# Altium schematic sheet 3V3_BUCK_0603.SchDoc
size A
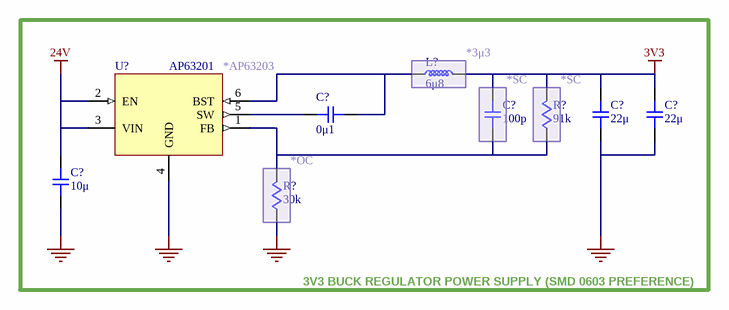
[diagram p0: 3V3_BUCK_0603.SchDoc]

## Parts
(Parts that share a designator on the sheet are numbered #1, #2 ... from top to bottom, then left to right.)
C?#1  0μ1  [MJB_CAP_0603]
C?#2  100p  [MJB_CAP_0603]
C?#3  22μ  [MJB_CAP_0805]
C?#4  22μ  [MJB_CAP_0805]
C?#5  10μ  [MJB_CAP_0805]
L?  6μ8  [MJB_IND_ASPI]
R?#1  91k  [MJB_RES_0603]
R?#2  30k  [MJB_RES_0603]
U?  AP63201  [mjb_AP6320X]

## Nets
3V3: C?#2.2 C?#3.2 C?#4.2 L?.2 R?#1.2
24V: C?#5.2 U?.2(EN) U?.3(VIN)
GND: C?#3.1 C?#4.1 C?#5.1 R?#2.1 U?.4(GND)
NetC?#1_1: C?#1.1 U?.5(SW)
NetC?#1_2: C?#1.2 L?.1 U?.6(BST)
NetC?#2_1: C?#2.1 R?#1.1 R?#2.2 U?.1(FB)

## Notes on the sheet
- (near U?) *AP63203
- (near L?) *3μ3
- *SC
- (near R?#2) *OC
- 3V3 BUCK REGULATOR POWER SUPPLY (SMD 0603 PREFERENCE)

## Library data of the parts
C?#1 C?#2 = CAP_0603: Capacitor SMD 0603; Manufacturer: *; Manufacturer Part Number: *; Distributor Link: *; LCSC: *; Rating: *; Dielectric: *
C?#3-C?#5 = CAP_0805: Capacitor SMD 0805; Manufacturer: *; Manufacturer Part Number: *; Distributor Link: *; LCSC: *; Rating: *; Dielectric: *
L? = IND_ASPI: Inductor Shielded Drum Core, Wirewound, Nonstandard
R?#1 R?#2 = RES_0603: Resistor SMD 0603
U? = AP6320x